# EAGLE design dronemonster (EAGLE 7.7.0)
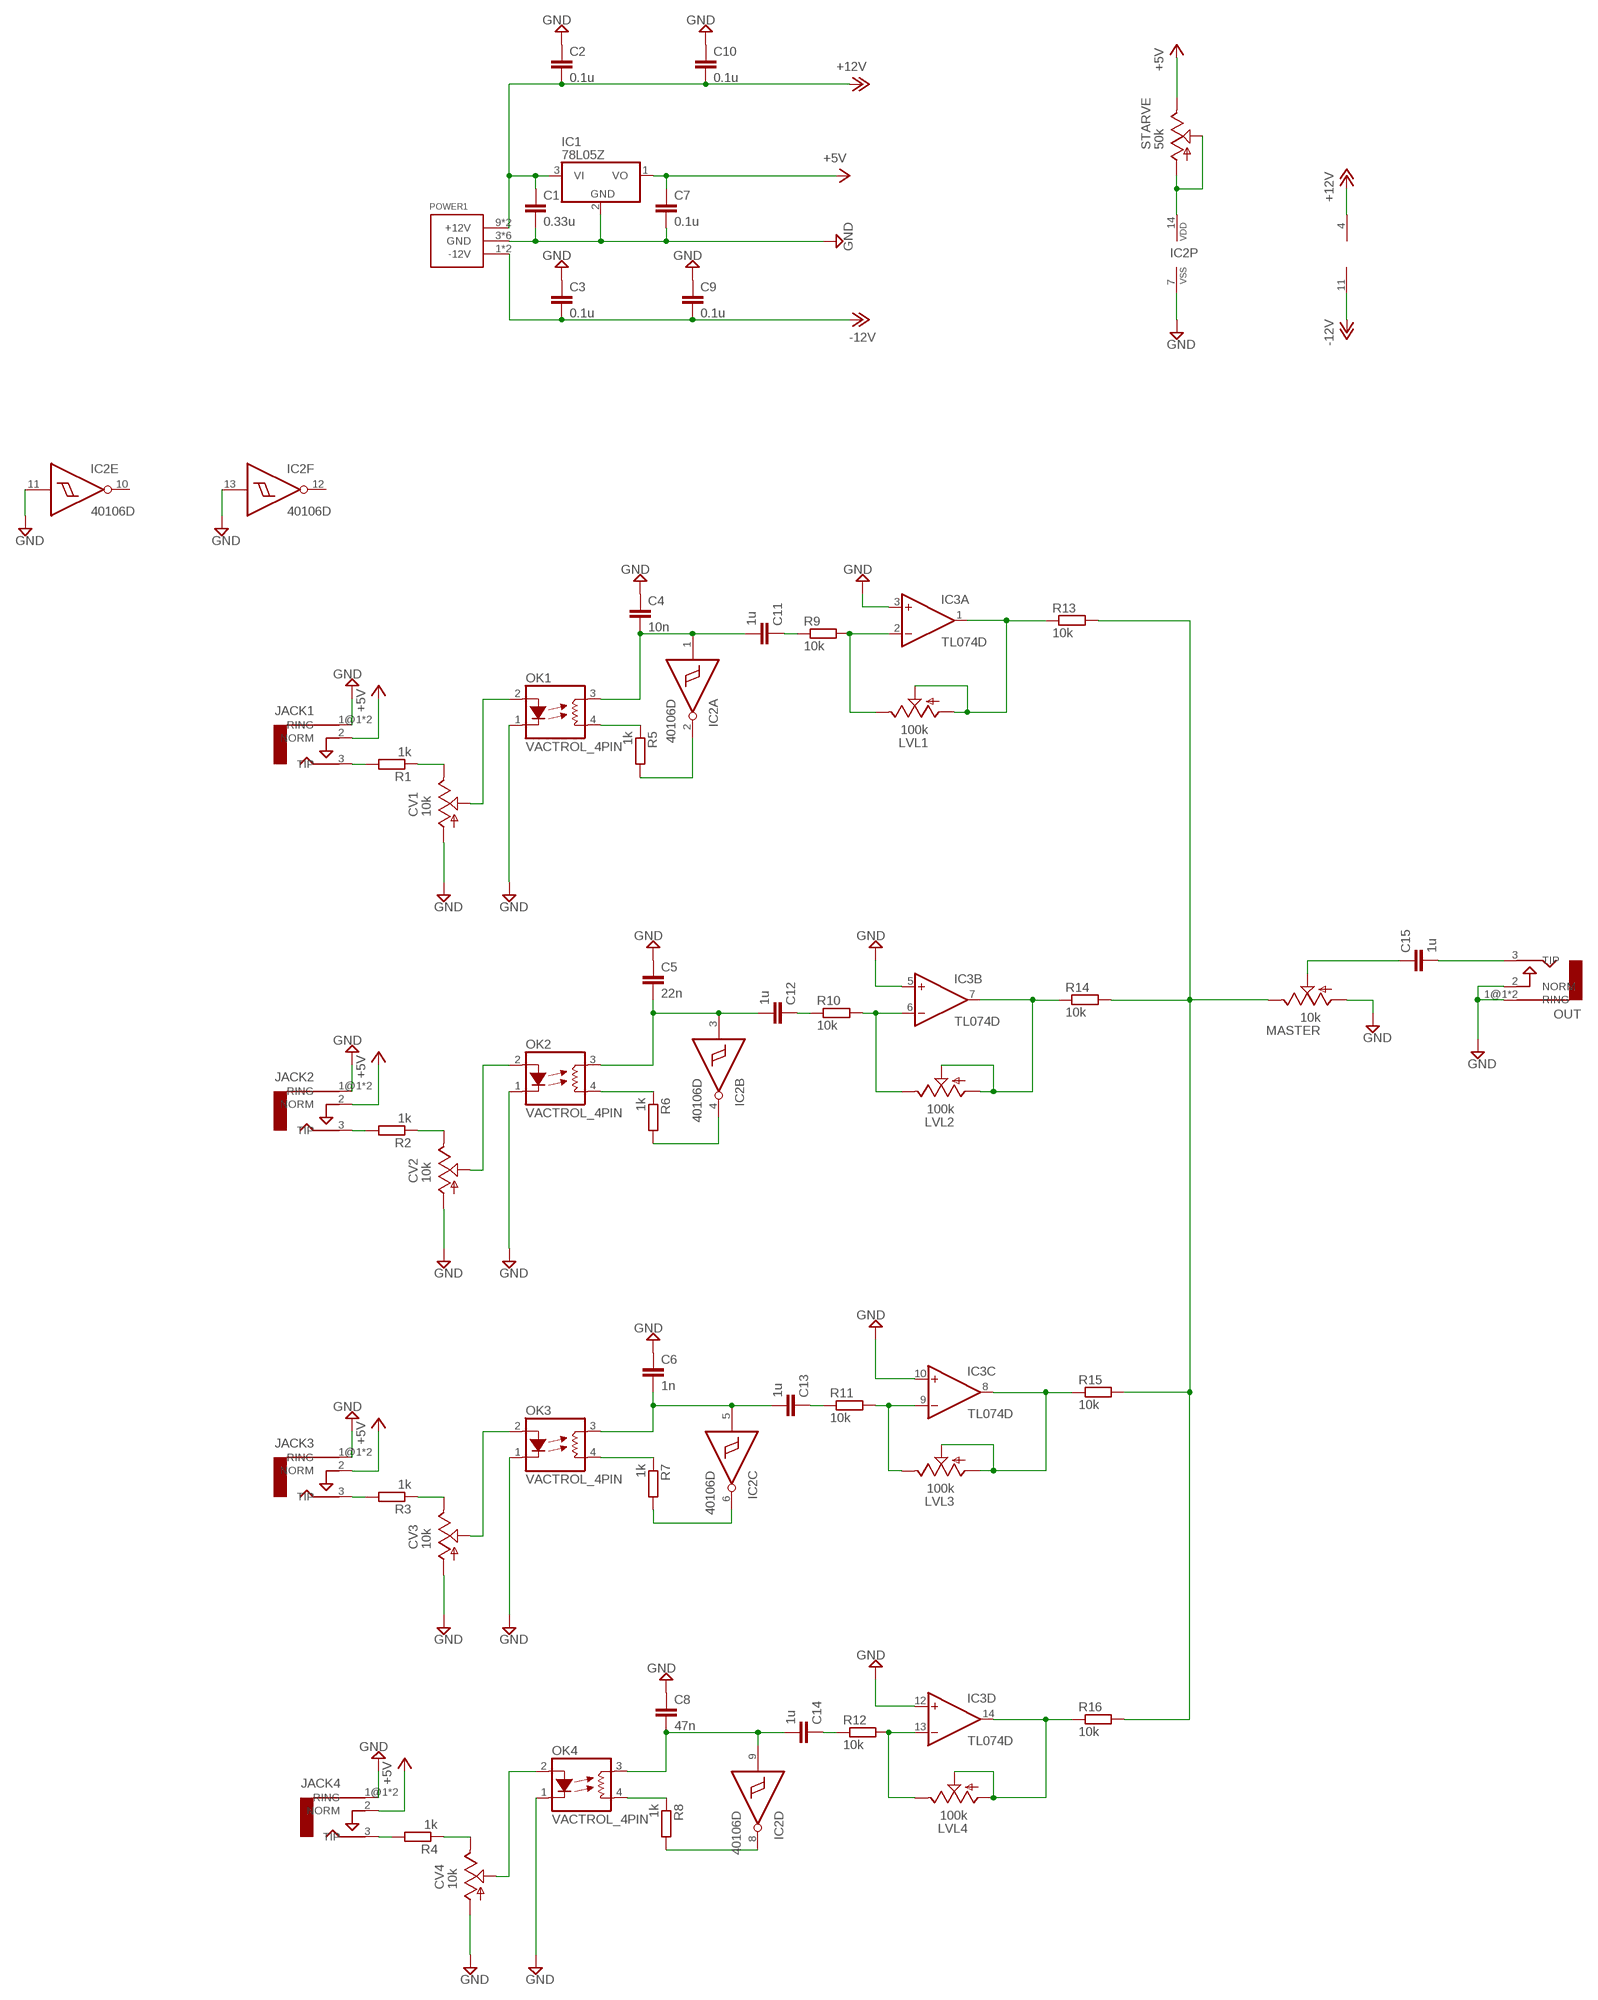
[diagram p0: schematic, sheet 1]

## Parts
C1  0.33u  C-EUC0805  [C0805]
C2  0.1u  C-EUC0805  [C0805]
C3  0.1u  C-EUC0805  [C0805]
C4  10n  C-EUC0805  [C0805]
C5  22n  C-EUC0805  [C0805]
C6  1n  C-EUC0805  [C0805]
C7  0.1u  C-EUC0805  [C0805]
C8  47n  C-EUC0805  [C0805]
C9  0.1u  C-EUC0805  [C0805]
C10  0.1u  C-EUC0805  [C0805]
C11  1u  C-EUC0805  [C0805]
C12  1u  C-EUC0805  [C0805]
C13  1u  C-EUC0805  [C0805]
C14  1u  C-EUC0805  [C0805]
C15  1u  C-EUC0805  [C0805]
CV1  10k  9MM_SNAP-IN_POT_  [9MM_SNAP-IN_POT]
CV2  10k  9MM_SNAP-IN_POT_  [9MM_SNAP-IN_POT]
CV3  10k  9MM_SNAP-IN_POT_  [9MM_SNAP-IN_POT]
CV4  10k  9MM_SNAP-IN_POT_  [9MM_SNAP-IN_POT]
IC1  78L05Z  [TO92]
IC2  40106D  [SO14]
IC3  TL074D  [SO14]
JACK1  IN1  AUDIO-JACKERTHENVAR  [ERTHENVAR-JACK]
JACK2  IN2  AUDIO-JACKERTHENVAR  [ERTHENVAR-JACK]
JACK3  IN3  AUDIO-JACKERTHENVAR  [ERTHENVAR-JACK]
JACK4  IN4  AUDIO-JACKERTHENVAR  [ERTHENVAR-JACK]
LVL1  100k  9MM_SNAP-IN_POT_  [9MM_SNAP-IN_POT]
LVL2  100k  9MM_SNAP-IN_POT_  [9MM_SNAP-IN_POT]
LVL3  100k  9MM_SNAP-IN_POT_  [9MM_SNAP-IN_POT]
LVL4  100k  9MM_SNAP-IN_POT_  [9MM_SNAP-IN_POT]
MASTER  10k  9MM_SNAP-IN_POT_  [9MM_SNAP-IN_POT]
OK1  VACTROL_4PIN  [VACTROL_4PIN_VTL5C]
OK2  VACTROL_4PIN  [VACTROL_4PIN_VTL5C]
OK3  VACTROL_4PIN  [VACTROL_4PIN_VTL5C]
OK4  VACTROL_4PIN  [VACTROL_4PIN_VTL5C]
OUT  OUT  AUDIO-JACKERTHENVAR  [ERTHENVAR-JACK]
POWER1  POWER_SIMPLE10  [POWER_10]
R1  1k  R-EU_R0805  [R0805]
R2  1k  R-EU_R0805  [R0805]
R3  1k  R-EU_R0805  [R0805]
R4  1k  R-EU_R0805  [R0805]
R5  1k  R-EU_R0805  [R0805]
R6  1k  R-EU_R0805  [R0805]
R7  1k  R-EU_R0805  [R0805]
R8  1k  R-EU_R0805  [R0805]
R9  10k  R-EU_R0805  [R0805]
R10  10k  R-EU_R0805  [R0805]
R11  10k  R-EU_R0805  [R0805]
R12  10k  R-EU_R0805  [R0805]
R13  10k  R-EU_R0805  [R0805]
R14  10k  R-EU_R0805  [R0805]
R15  10k  R-EU_R0805  [R0805]
R16  10k  R-EU_R0805  [R0805]
STARVE  50k  9MM_SNAP-IN_POT_  [9MM_SNAP-IN_POT]

## Nets
+5V: C7.1 IC1.1(VO) JACK1.2(NORM) JACK2.2(NORM) JACK3.2(NORM) JACK4.2(NORM) STARVE.3(E)
+12V: C1.1 C2.2 C10.2 IC1.3(VI) IC3.4(P:V+) POWER1.9(+12V) POWER1.10(+12V)
-12V: C3.2 C9.2 IC3.11(P:V-) POWER1.1(-12V) POWER1.2(-12V)
GND: C1.2 C2.1 C3.1 C4.1 C5.1 C6.1 C7.2 C8.1 C9.1 C10.1 CV1.1(A) CV2.1(A) CV3.1(A) CV4.1(A) IC1.2(GND) IC2.7(P:VSS) IC2.11(E:I) IC2.13(F:I) IC3.3(A:+IN) IC3.5(B:+IN) IC3.10(C:+IN) IC3.12(D:+IN) JACK1.1@1(RING) JACK1.1@2(RING) JACK2.1@1(RING) JACK2.1@2(RING) JACK3.1@1(RING) JACK3.1@2(RING) JACK4.1@1(RING) JACK4.1@2(RING) MASTER.1(A) OK1.1(LED-) OK2.1(LED-) OK3.1(LED-) OK4.1(LED-) OUT.1@1(RING) OUT.1@2(RING) OUT.2(NORM) POWER1.3(GND) POWER1.4(GND) POWER1.5(GND) POWER1.6(GND) POWER1.7(GND) POWER1.8(GND)
N$1: C14.1 R12.1
N$2: IC2.14(P:VDD) STARVE.1(A) STARVE.2(S)
N$3: JACK1.3(TIP) R1.2
N$4: CV1.2(S) OK1.2(LED+)
N$5: C15.1 MASTER.2(S)
N$6: CV1.3(E) R1.1
N$7: C13.1 R11.1
N$8: C12.1 R10.1
N$9: C11.1 R9.1
N$10: CV2.3(E) R2.1
N$11: IC3.13(D:-IN) LVL4.3(E) R12.2
N$12: JACK2.3(TIP) R2.2
N$13: IC3.9(C:-IN) LVL3.3(E) R11.2
N$14: CV2.2(S) OK2.2(LED+)
N$15: IC3.6(B:-IN) LVL2.3(E) R10.2
N$16: CV3.3(E) R3.1
N$17: IC3.2(A:-IN) LVL1.3(E) R9.2
N$18: JACK3.3(TIP) R3.2
N$19: IC3.1(A:OUT) LVL1.1(A) LVL1.2(S) R13.1
N$20: CV3.2(S) OK3.2(LED+)
N$21: MASTER.3(E) R13.2 R14.2 R15.2 R16.2
N$22: CV4.3(E) R4.1
N$23: C15.2 OUT.3(TIP)
N$24: JACK4.3(TIP) R4.2
N$26: CV4.2(S) OK4.2(LED+)
N$27: IC3.14(D:OUT) LVL4.1(A) LVL4.2(S) R16.1
N$29: OK4.4(RES2) R8.1
N$30: IC2.8(D:O) R8.2
N$31: C8.2 C14.2 IC2.9(D:I) OK4.3(RES1)
N$32: OK3.4(RES2) R7.1
N$33: IC2.6(C:O) R7.2
N$34: C6.2 C13.2 IC2.5(C:I) OK3.3(RES1)
N$35: OK2.4(RES2) R6.1
N$36: IC2.4(B:O) R6.2
N$37: C5.2 C12.2 IC2.3(B:I) OK2.3(RES1)
N$38: OK1.4(RES2) R5.1
N$39: IC2.2(A:O) R5.2
N$40: C4.2 C11.2 IC2.1(A:I) OK1.3(RES1)
N$41: IC3.8(C:OUT) LVL3.1(A) LVL3.2(S) R15.1
N$42: IC3.7(B:OUT) LVL2.1(A) LVL2.2(S) R14.1
Unconnected: IC2.10(E:O) IC2.12(F:O)

## Library data of the parts
C1-C15 = rcl:C-EU: CAPACITOR, European symbol
CV1-CV4 LVL1-LVL4 MASTER STARVE = MusicThingModular:9MM_SNAP-IN_POT: 9mm vertical snap-in pot, Alpha / Panasonic style
IC1 = linear:78*: Positive VOLTAGE REGULATOR Source: http://cache.national.com/ds/LM/LM78L05.pdf http://www.fairchildsemi.com/ds/LM/LM7805.pdf
IC2 = 40xx:40106: Hex SCHMITT TRIGGER
IC3 = linear:TL074: OP AMP
JACK1-JACK4 OUT = erthenvar:AUDIO-JACK: Switching Mono 3.5mm Audio Jack from Erthenvar.
OK1-OK4 = MusicThingModular:VACTROL_4PIN: 4 Pin Vactrol Resistive Photocoupler
POWER1 = eurorack:POWER_SIMPLE
R1-R16 = rcl:R-EU_: RESISTOR, European symbol

## Board
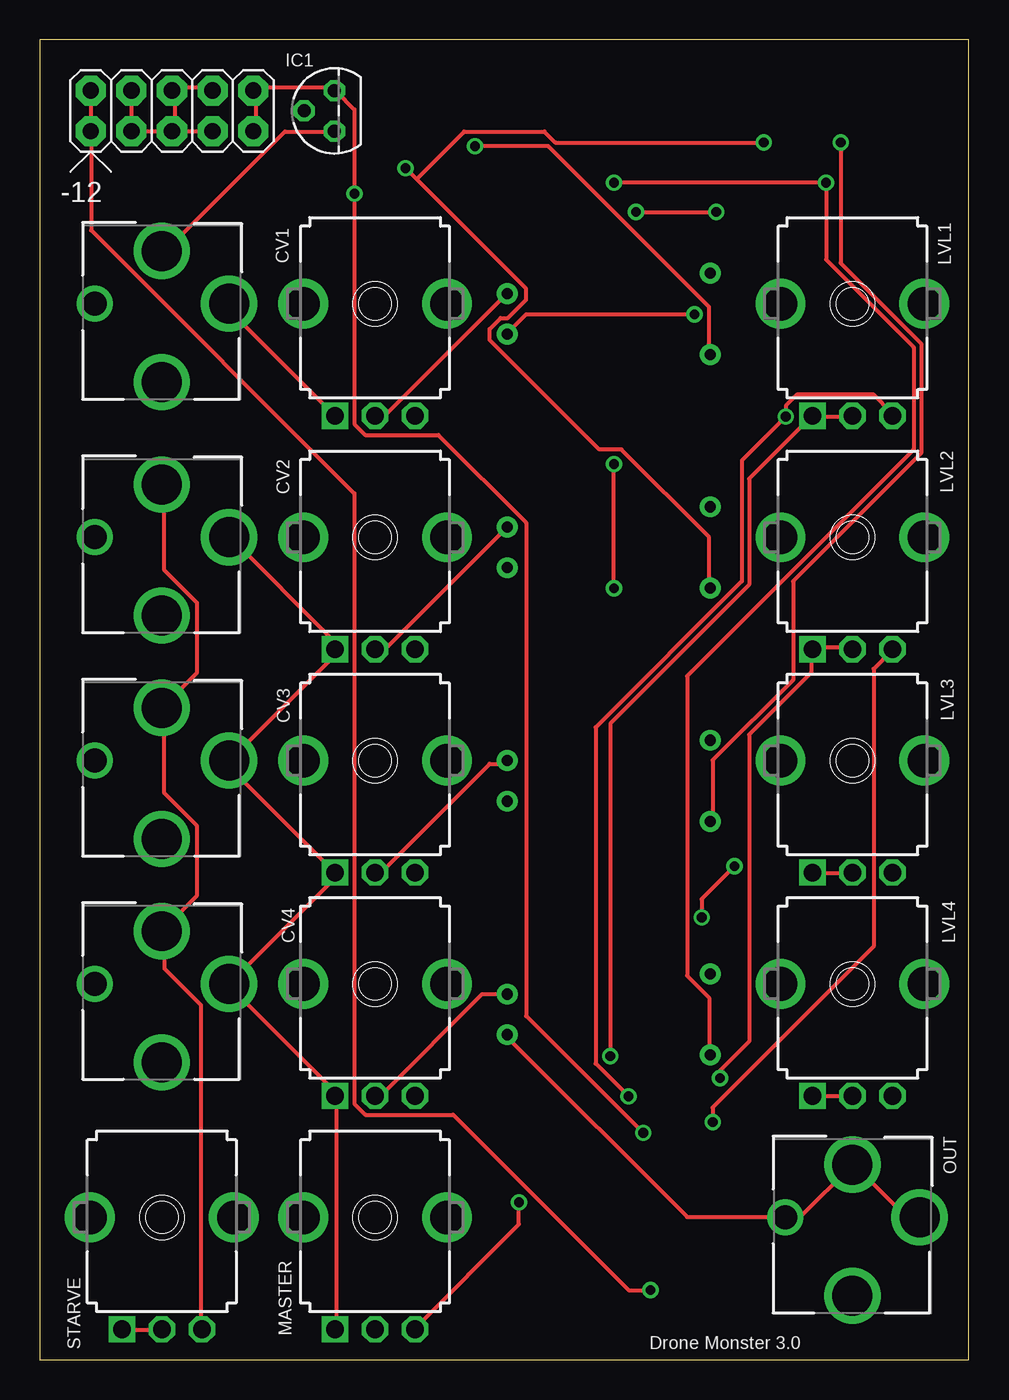
[diagram p1: board, top side]
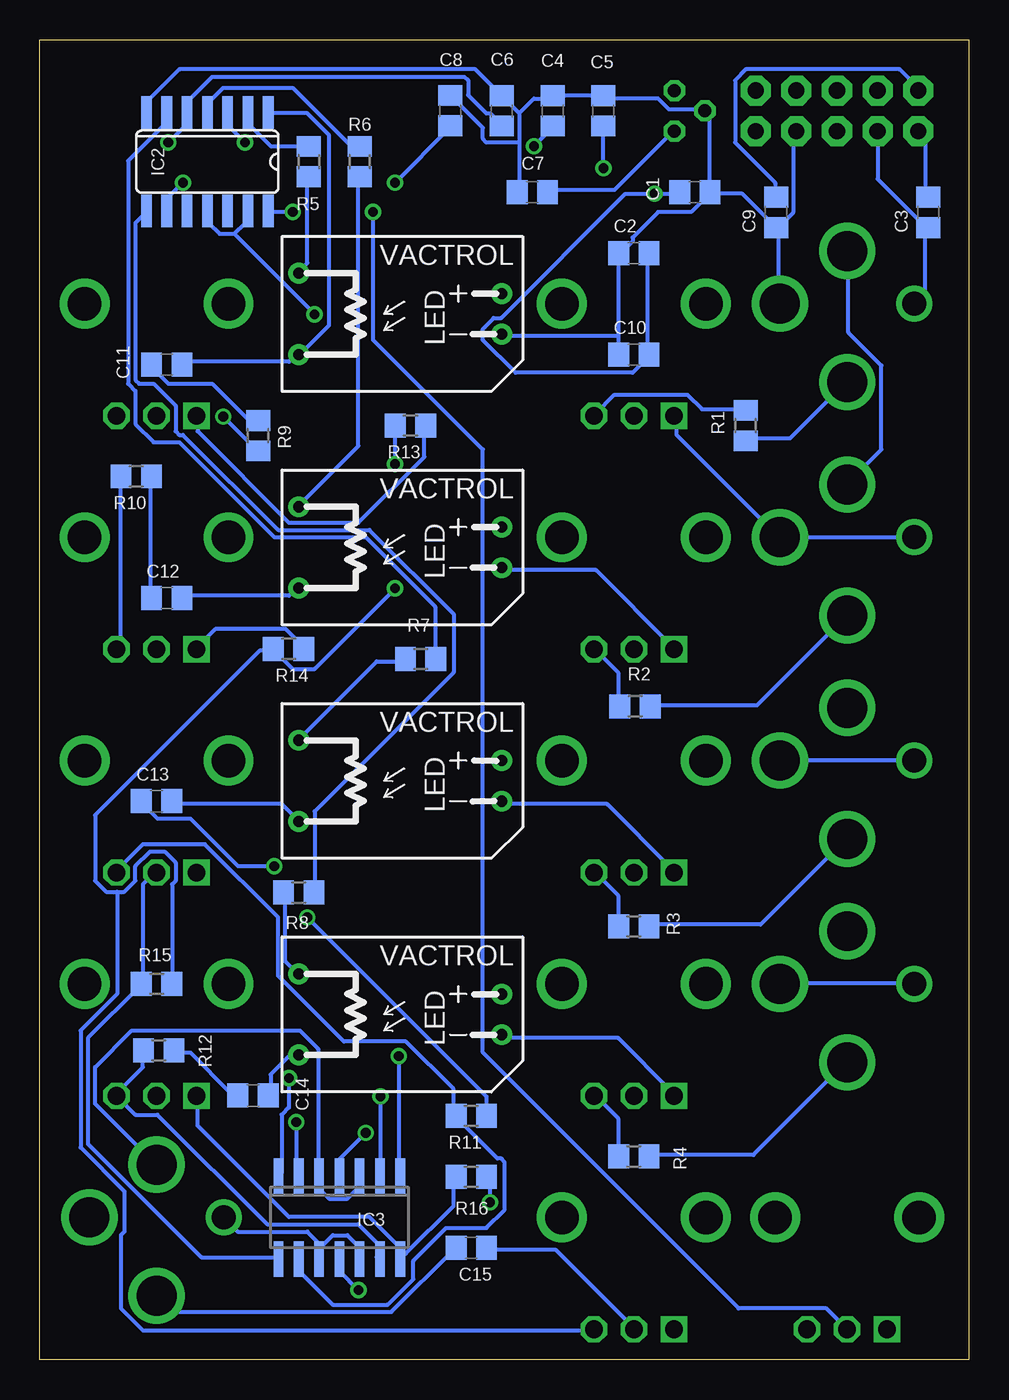
[diagram p2: board, bottom side, seen from below]

Size 58.09 x 82.54 mm. Coordinates in mm from the lower left corner, seen from the top.
Outline: 0,0 58.09,0 58.09,82.54 0,82.54 0,0
Copper layers (1*16): Top 0.035mm / dielectric 1.5mm / Bottom 0.035mm
Design rules "default": minimum track width 10mil, minimum drill 24mil, track to track 8mil, track to pad 8mil, pad to pad 8mil, via to via 8mil, smd to smd 8mil, copper to edge 40mil, drill to drill 8mil, minimum pad ring 10mil, minimum via ring 8mil, stop-mask expansion 4mil, vias tented up to drill 0mil, thermal gap 10mil

### Footprints (pad centres in the part's own frame; a part is rotated, then mirrored left to right if it is on the bottom)
C0805 = smd 1.3 x 1.5: 1 -0.95,0; 2 0.95,0
9MM_SNAP-IN_POT = drill 1.1 square: 1 -2.5,-7 | drill 1.1 octagon: 2 0,-7; 3 2.5,-7 | drill 2.1 pad 2.794: CHASSIS1 -4.5,0; CHASSIS2 4.5,0
TO92 = drill 0.813 octagon: 1 -1.27,0; 2 0,1.905; 3 1.27,0
SO14 = smd 0.66 x 2.032: 1 -3.81,-3.073; 2 -2.54,-3.073; 3 -1.27,-3.073; 4 0,-3.073; 5 1.27,-3.073; 6 2.54,-3.073; 7 3.81,-3.073; 8 3.81,3.073; 9 2.54,3.073; 10 1.27,3.073; 11 0,3.073; 12 -1.27,3.073; 13 -2.54,3.073; 14 -3.81,3.073
SO14' = smd 0.6 x 2.2: 1 -3.81,-2.6; 2 -2.54,-2.6; 3 -1.27,-2.6; 4 0,-2.6; 5 1.27,-2.6; 6 2.54,-2.6; 7 3.81,-2.6; 8 3.81,2.6; 9 2.54,2.6; 10 1.27,2.6; 11 0,2.6; 12 -1.27,2.6; 13 -2.54,2.6; 14 -3.81,2.6
ERTHENVAR-JACK = drill 2.5: 1@1 -4.2,0; 2 0,-3.3; 3 0,4.9 | drill 1.5: 1@2 4.2,0
VACTROL_4PIN_VTL5C = drill 0.7 pad 1.3: 1 -6.35,1.27; 2 -6.35,-1.27; 3 6.35,2.54; 4 6.35,-2.54
POWER_10 = drill 1.016 pad 1.88 octagon: 1 -5.08,-1.27; 2 -5.08,1.27; 3 -2.54,-1.27; 4 -2.54,1.27; 5 0,-1.27; 6 0,1.27; 7 2.54,-1.27; 8 2.54,1.27; 9 5.08,-1.27; 10 5.08,1.27
R0805 = smd 1.3 x 1.5: 1 -0.95,0; 2 0.95,0

### Placement (x,y rotation side)
C1  17.14,73.03 0 bottom
C2  20.95,69.22 0 bottom
C3  2.54,71.75 90 bottom
C4  26.04,78.11 270 bottom
C5  22.86,78.11 270 bottom
C6  29.21,78.11 270 bottom
C7  27.3,73.03 180 bottom
C8  32.44,78.12 270 bottom
C9  12.06,71.75 90 bottom
C10  20.95,62.87 0 bottom
C11  50.16,62.23 0 bottom
C12  50.16,47.62 0 bottom
C13  50.8,34.92 0 bottom
C14  44.77,16.51 0 bottom
C15  31.11,6.99 180 bottom
CV1  20.95,66.04 0 top
CV2  20.95,51.44 0 top
CV3  20.95,37.47 0 top
CV4  20.95,23.5 0 top
IC1  18.41,78.11 90 top
IC2  47.62,74.93 180 bottom
IC3  TL074D  [SO14']  39.37,8.89 180 bottom
JACK1  7.62,66.04 180 top
JACK2  7.62,51.44 180 top
JACK3  7.62,37.47 180 top
JACK4  7.62,23.5 180 top
LVL1  50.8,66.04 0 top
LVL2  50.8,51.44 0 top
LVL3  50.8,37.47 0 top
LVL4  50.8,23.5 0 top
MASTER  20.95,8.89 0 top
OK1  35.56,65.41 180 bottom
OK2  35.56,50.8 180 bottom
OK3  35.56,36.2 180 bottom
OK4  35.56,21.59 180 bottom
OUT  50.8,8.89 180 top
POWER1  8.26,78.11 0 top
R1  13.97,58.42 270 bottom
R2  20.88,40.86 0 bottom
R3  20.95,27.09 0 bottom
R4  20.95,12.7 0 bottom
R5  41.27,74.93 90 bottom
R6  38.1,74.93 90 bottom
R7  34.29,43.81 0 bottom
R8  41.91,29.21 0 bottom
R9  44.45,57.78 270 bottom
R10  52.07,55.24 180 bottom
R11  31.11,15.24 180 bottom
R12  50.66,19.34 180 bottom
R13  34.92,58.42 180 bottom
R14  42.55,44.45 180 bottom
R15  50.8,23.5 0 bottom
R16  31.11,11.43 0 bottom
STARVE  7.62,8.89 0 top

### Tracks (layer width: path | path; a pad name or v marks a point on that pad's centre or on a via)
+5V
  Top 0.254: IC1.1 18.29,76.81 15.32,76.81 7.77,69.27 JACK1.2 | STARVE.3 10.06,2.06 10.06,22.17 7.77,24.46 7.77,26.75 JACK4.2 7.77,26.98 9.83,29.03 9.83,33.38 7.77,35.43 7.77,40.69 JACK3.2 7.77,40.92 9.83,42.98 9.83,47.32 7.77,49.38 7.77,54.63 JACK2.2
  Bottom 0.254: C7.1 26.29,73.15 22.17,73.15 18.52,76.81 IC1.1 | JACK1.2 7.54,69.27 7.54,64.24 5.49,62.18 5.49,56.92 7.54,54.86 JACK2.2
+12V  (via drill 0.61)
  Top 0.254: POWER1.9 13.49,77.04 13.49,79.32 POWER1.10 13.49,79.55 18.29,79.55 IC1.3 18.52,79.32 19.66,78.18 v19.66,72.92 19.66,58.52 20.34,57.84 24.92,57.84 30.4,52.35 30.4,21.49 v37.72,14.17
  Bottom 0.254: C2.2 20.12,69.04 20.12,62.87 C10.2 19.89,62.87 21.03,61.72 28.35,61.72 30.4,63.78 30.4,64.47 29.72,65.15 29.26,65.15 21.49,72.92 v19.66,72.92 18.29,72.92 C1.1 | v37.72,14.17 39.32,12.57 39.32,11.66 IC3.4
-12V  (via drill 0.61)
  Top 0.254: v38.18,4.34 36.8,4.34 25.83,15.32 20.34,15.32 19.66,16 19.66,54.18 3.2,70.64 3.2,76.81 POWER1.1 3.2,77.04 3.2,79.32 POWER1.2
  Bottom 0.254: C9.2 12.12,72.92 12.12,73.61 14.63,76.12 14.63,80.01 13.95,80.7 4.34,80.7 3.2,79.55 POWER1.2 | C3.2 2.74,72.92 2.74,76.58 2.97,76.81 POWER1.1 | v38.18,4.34 39.32,5.49 39.32,6.17 IC3.11
GND  (via drill 0.61)
  Top 0.254: v40.92,65.38 30.4,65.38 29.26,64.24 OK1.1 | POWER1.8 10.74,79.55 8.46,79.55 POWER1.6 8.46,79.32 8.46,77.04 POWER1.5 | POWER1.4 POWER1.3 5.71,76.81 8.23,76.81 POWER1.5 | POWER1.5 8.46,76.81 10.74,76.81 POWER1.7 | CV1.1 18.29,59.21 11.66,65.84 JACK1.1@1 | JACK2.1@1 11.89,51.44 18.29,45.03 18.29,44.58 CV2.1 18.29,44.35 18.29,43.89 11.89,37.49 JACK3.1@1 11.66,37.26 18.29,30.63 CV3.1 18.29,30.4 18.29,29.95 11.89,23.55 JACK4.1@1 11.89,23.32 18.52,16.69 CV4.1 18.52,16.46 18.52,2.06 MASTER.1 | OUT.1@1 54.86,8.91 54.18,8.91 50.98,12.12 OUT.2 50.75,12.12 47.55,8.91 46.63,8.91 OUT.1@2 46.41,8.91 40.46,8.91 29.26,20.12 OK4.1
  Bottom 0.254: 28.12,77.95 28.12,76.12 | 28.12,76.12 28.12,73.15 C7.2 | 28.12,77.95 29.03,78.87 C6.1 29.26,79.1 30.86,80.7 49.38,80.7 51.44,78.64 IC2.7 | 28.12,76.12 30.18,76.12 30.4,76.35 30.4,77.04 32.23,78.87 C8.1 | 28.12,77.95 27.2,78.87 26.06,78.87 C4.1 25.83,79.1 22.86,79.1 C5.1 22.86,78.87 19.43,78.87 18.75,78.18 16.69,78.18 IC1.2 16.46,77.95 16.23,77.72 16.23,73.15 C1.2 | 45.95,70.41 45.26,71.09 45.26,71.78 IC2.13 | 45.95,70.41 46.86,70.41 47.55,71.09 47.55,71.78 IC2.11 | 21.95,64.01 21.95,69.04 C2.1 21.72,69.27 21.03,69.95 21.03,70.18 19.43,71.78 17.37,71.78 16.23,72.92 C1.2 | 21.95,64.01 21.95,62.87 C10.1 | 21.95,64.01 29.03,64.01 OK1.1 | v40.92,65.38 45.95,70.41 | JACK1.1@2 3.2,66.06 2.74,66.52 2.74,70.64 C3.1 2.74,70.87 5.71,73.84 POWER1.3 | C9.1 11.89,70.64 11.89,66.06 JACK1.1@1 | C1.2 16,72.92 14.17,72.92 12.12,70.87 C9.1 | POWER1.7 10.97,76.81 10.97,71.78 11.89,70.87 C9.1 | OK2.1 29.03,49.38 23.32,49.38 18.52,44.58 CV2.1 | JACK2.1@2 JACK2.1@1 11.89,51.44 18.29,57.84 18.29,58.98 CV1.1 | OK3.1 29.03,34.75 22.63,34.75 18.52,30.63 CV3.1 | JACK3.1@2 3.43,37.49 11.66,37.49 JACK3.1@1 | 40.46,7.09 39.78,7.77 38.86,7.77 38.18,7.09 38.18,6.4 IC3.12 | 40.46,7.09 40.46,6.4 IC3.10 40.46,7.09 | 40.46,7.09 41.38,8 45.72,8 46.41,8.69 OUT.1@2 | IC3.3 38.18,11.43 38.18,10.74 38.86,10.06 40.01,10.06 40.46,10.52 40.46,11.43 IC3.5 40.69,11.66 40.69,19.43 41.83,20.57 52.35,20.57 54.63,18.29 54.63,16 50.98,12.34 OUT.2 | JACK4.1@2 3.43,23.55 11.66,23.55 JACK4.1@1 | OK4.1 29.03,20.12 21.95,20.12 18.52,16.69 CV4.1
N$1
  Bottom 0.254: C14.1 45.72,16.69 46.18,16.69 48.69,19.2 49.61,19.2 R12.1
N$2  (via drill 0.61)
  Top 0.254: v37.26,71.78 v42.29,71.78 | STARVE.1 5.26,1.83 7.54,1.83 STARVE.2
  Bottom 0.254: v42.29,71.78 43.66,71.78 IC2.14 | v37.26,71.78 37.26,63.78 30.4,56.92 30.4,19.2 14.4,3.2 8.91,3.2 7.77,2.06 STARVE.2
N$3
  Bottom 0.254: R1.2 13.95,57.61 11.2,57.61 7.77,61.04 JACK1.3
N$4
  Top 0.254: OK1.2 29.03,66.52 21.72,59.21 21.03,59.21 CV1.2
N$5
  Bottom 0.254: C15.1 29.95,6.86 25.83,6.86 21.03,2.06 MASTER.2
N$6
  Bottom 0.254: R1.1 14.17,59.44 16.69,59.44 17.6,60.35 22.17,60.35 23.32,59.21 CV1.3
N$7  (via drill 0.61)
  Top 0.254: v41.38,27.66 41.38,28.8 v43.43,30.86
  Bottom 0.254: v41.38,27.66 30.18,16.46 30.18,15.32 R11.1 | v43.43,30.86 45.72,30.86 48.69,33.83 50.75,33.83 51.66,34.75 C13.1
N$8
  Bottom 0.254: C12.1 51.21,47.78 51.21,55.09 R10.1
N$9
  Bottom 0.254: R9.1 44.58,58.75 45.03,58.75 47.32,61.04 50.06,61.04 51.21,62.18 C11.1
N$10
  Bottom 0.254: R2.1 21.95,40.92 21.95,42.98 23.32,44.35 CV2.3
N$11
  Bottom 0.254: R12.2 51.66,19.2 51.66,18.29 53.26,16.69 LVL4.3 53.26,16.46 52.12,15.32 50.75,15.32 43.89,8.46 38.18,8.46 37.03,7.32 37.03,6.4 IC3.13
N$12
  Bottom 0.254: R2.2 19.89,40.92 13.26,40.92 7.77,46.41 JACK2.3
N$13
  Bottom 0.254: IC3.9 41.83,6.17 41.83,5.49 39.78,3.43 36.35,3.43 34.75,5.03 34.75,6.17 32.69,8.23 30.18,8.23 29.03,9.37 29.03,12.34 29.26,12.57 29.49,12.57 32,15.09 R11.2 32.23,15.32 32.23,16.92 35.2,19.89 39.09,19.89 43.2,24 43.2,27.66 47.78,32.23 51.66,32.23 53.26,30.63 LVL3.3
N$14
  Top 0.254: OK2.2 21.72,44.58 21.03,44.58 CV2.2
N$15  (via drill 0.61)
  Top 0.254: v42.06,14.86 42.06,15.77 52.12,25.83 52.12,43.2 53.26,44.35 LVL2.3
  Bottom 0.254: R10.2 53.03,55.09 53.03,44.81 53.26,44.58 LVL2.3 | v42.06,14.86 42.06,11.66 IC3.6
N$16
  Bottom 0.254: R3.1 21.95,27.2 21.95,29.03 23.32,30.4 CV3.3
N$17  (via drill 0.61)
  Top 0.254: LVL1.3 53.26,59.21 52.12,60.35 47.32,60.35 46.63,59.66 v46.63,58.98 43.89,56.24 43.89,48.69 34.75,39.55 34.75,18.52 v36.8,16.46
  Bottom 0.254: v46.63,58.98 44.58,56.92 R9.2 | v36.8,16.46 36.8,11.66 IC3.2
N$18
  Bottom 0.254: R3.2 19.89,27.2 13.03,27.2 7.77,32.46 JACK3.3
N$19  (via drill 0.61)
  Top 0.254: v35.66,18.97 35.66,39.78 44.35,48.46 44.35,55.09 48.23,58.98 LVL1.1 48.46,58.98 50.75,58.98 LVL1.2
  Bottom 0.254: R13.1 34.06,58.29 34.06,56.46 38.18,52.35 42.52,52.35 48.23,58.06 48.23,58.98 LVL1.1 | v35.66,18.97 35.66,11.66 IC3.1
N$20
  Top 0.254: OK3.2 29.03,37.26 28.12,37.26 21.49,30.63 21.03,30.63 CV3.2
N$21  (via drill 0.61)
  Top 0.254: v29.95,9.83 29.95,8.46 23.55,2.06 MASTER.3 | v35.89,48.23 v35.89,56.01
  Bottom 0.254: v29.95,9.83 29.95,11.43 R16.2 | 53.26,29.26 53.95,29.26 54.63,29.95 54.63,34.06 44.35,44.35 43.66,44.35 R14.2 43.43,44.35 42.29,43.2 40.92,43.2 v35.89,48.23 | 53.26,29.26 52.81,29.26 52.12,29.95 52.12,30.86 51.21,31.77 50.29,31.77 49.61,31.09 49.61,29.95 49.84,29.72 49.84,23.55 R15.2 | v35.89,56.01 35.89,58.29 R13.2 | 53.26,29.26 53.26,22.86 55.55,20.57 55.55,13.26 52.81,10.52 52.81,8 53.03,7.77 53.03,3.2 51.66,1.83 23.55,1.83 MASTER.3
N$22
  Bottom 0.254: R4.1 21.95,12.8 21.95,15.09 23.32,16.46 CV4.3
N$23
  Bottom 0.254: C15.2 32.23,6.86 36.12,2.97 49.84,2.97 50.75,3.89 OUT.3
N$24
  Bottom 0.254: R4.2 19.89,12.8 13.49,12.8 7.77,18.52 JACK4.3
N$26
  Top 0.254: OK4.2 27.66,22.86 21.49,16.69 21.03,16.69 CV4.2
N$27
  Top 0.254: LVL4.1 48.46,16.46 50.75,16.46 LVL4.2
  Bottom 0.254: 35.2,6.63 35.43,6.4 IC3.14 | 35.2,6.63 32.23,9.6 32.23,11.43 R16.1 | 35.2,6.63 37.49,8.91 42.52,8.91 48.23,14.63 48.23,16.46 LVL4.1
N$29
  Bottom 0.254: R8.1 42.75,29.03 42.75,24.92 42.06,24.23 OK4.4
N$30
  Bottom 0.254: R8.2 40.92,29.26 40.92,34.29 32.23,42.98 32.23,46.63 37.49,51.89 43.2,51.89 49.15,57.84 49.38,57.84 49.61,58.06 49.61,59.66 50.98,61.04 51.89,61.04 52.12,61.27 52.12,71.09 51.44,71.78 IC2.8
N$31  (via drill 0.61)
  Top 0.254: v35.89,73.61 v49.15,73.61 49.15,68.81 54.63,63.32 54.63,56.92 40.46,42.75 40.46,24 41.83,22.63 41.83,19.2 OK4.3
  Bottom 0.254: C14.2 43.66,16.69 43.66,17.83 42.52,18.97 42.06,18.97 OK4.3 | v35.89,73.61 32.46,77.04 C8.2 | v49.15,73.61 50.06,72.69 50.06,72.01 IC2.9
N$32
  Bottom 0.254: R7.1 35.43,43.66 37.03,43.66 41.83,38.86 OK3.4
N$33
  Bottom 0.254: R7.2 33.38,43.89 33.38,47.09 37.72,51.44 43.43,51.44 49.38,57.38 50.98,57.38 52.12,58.52 52.12,60.58 52.58,61.04 52.58,74.98 50.29,77.27 50.29,77.95 IC2.6
N$34  (via drill 0.61)
  Top 0.254: v50.06,76.12 50.06,68.58 55.09,63.55 55.09,56.69 47.09,48.69 47.09,42.52 42.06,37.49 42.06,33.83 OK3.3
  Bottom 0.254: C13.2 49.84,34.75 42.98,34.75 42.06,33.83 OK3.3 | C6.2 29.26,77.27 29.95,77.95 30.18,77.95 31.32,79.1 31.32,80.01 31.55,80.24 47.32,80.24 48.69,78.87 48.69,78.18 IC2.5 48.92,77.95 48.92,77.27 v50.06,76.12
N$35
  Bottom 0.254: R6.1 38.18,73.84 38.18,57.15 41.83,53.49 OK2.4
N$36
  Bottom 0.254: R6.2 38.18,75.89 38.63,75.89 42.29,79.55 46.63,79.55 47.55,78.64 47.55,78.18 IC2.4
N$37  (via drill 0.61)
  Top 0.254: 23.55,73.84 30.4,66.98 30.4,66.29 29.26,65.15 28.8,65.15 28.12,64.47 28.12,63.78 34.98,56.92 36.35,56.92 41.83,51.44 41.83,48.46 OK2.3 | 23.55,73.84 v22.86,74.52 | v45.26,76.12 32.23,76.12 31.55,76.81 26.52,76.81 23.55,73.84
  Bottom 0.254: v22.86,74.52 C5.2 | C12.2 49.15,47.78 42.52,47.78 42.06,48.23 OK2.3 | v45.26,76.12 46.18,77.04 46.18,77.95 IC2.3
N$38
  Bottom 0.254: R5.1 41.38,73.84 41.38,68.58 41.83,68.12 OK1.4
N$39
  Bottom 0.254: R5.2 41.38,75.89 43.66,75.89 45.03,77.27 45.03,77.95 IC2.2
N$40  (via drill 0.61)
  Top 0.254: v27.2,75.89 31.77,75.89 41.83,65.84 41.83,62.87 OK1.3
  Bottom 0.254: v27.2,75.89 26.06,77.04 C4.2 | C11.2 49.15,62.41 42.52,62.41 42.06,62.87 OK1.3 41.83,62.87 40.01,64.69 40.01,76.58 41.38,77.95 43.66,77.95 IC2.1
N$41
  Top 0.254: LVL3.1 48.46,30.4 50.75,30.4 LVL3.2
  Bottom 0.254: LVL3.2 50.98,30.4 51.66,29.72 51.66,23.55 R15.1 51.89,23.32 55.09,20.12 55.09,13.49 48.01,6.4 43.2,6.4 IC3.8
N$42  (via drill 0.61)
  Top 0.254: v42.52,17.6 42.52,18.06 44.35,19.89 44.35,39.09 48.23,42.98 48.23,44.35 LVL2.1 48.46,44.58 50.75,44.58 LVL2.2
  Bottom 0.254: R14.1 41.6,44.58 42.75,45.72 47.09,45.72 48.23,44.58 LVL2.1 | v42.52,17.6 42.52,15.77 42.98,15.32 42.98,11.66 IC3.7

### Text on the board
tNames: Drone Monster 3.0